# EAGLE design Terv (EAGLE 9.5.2)
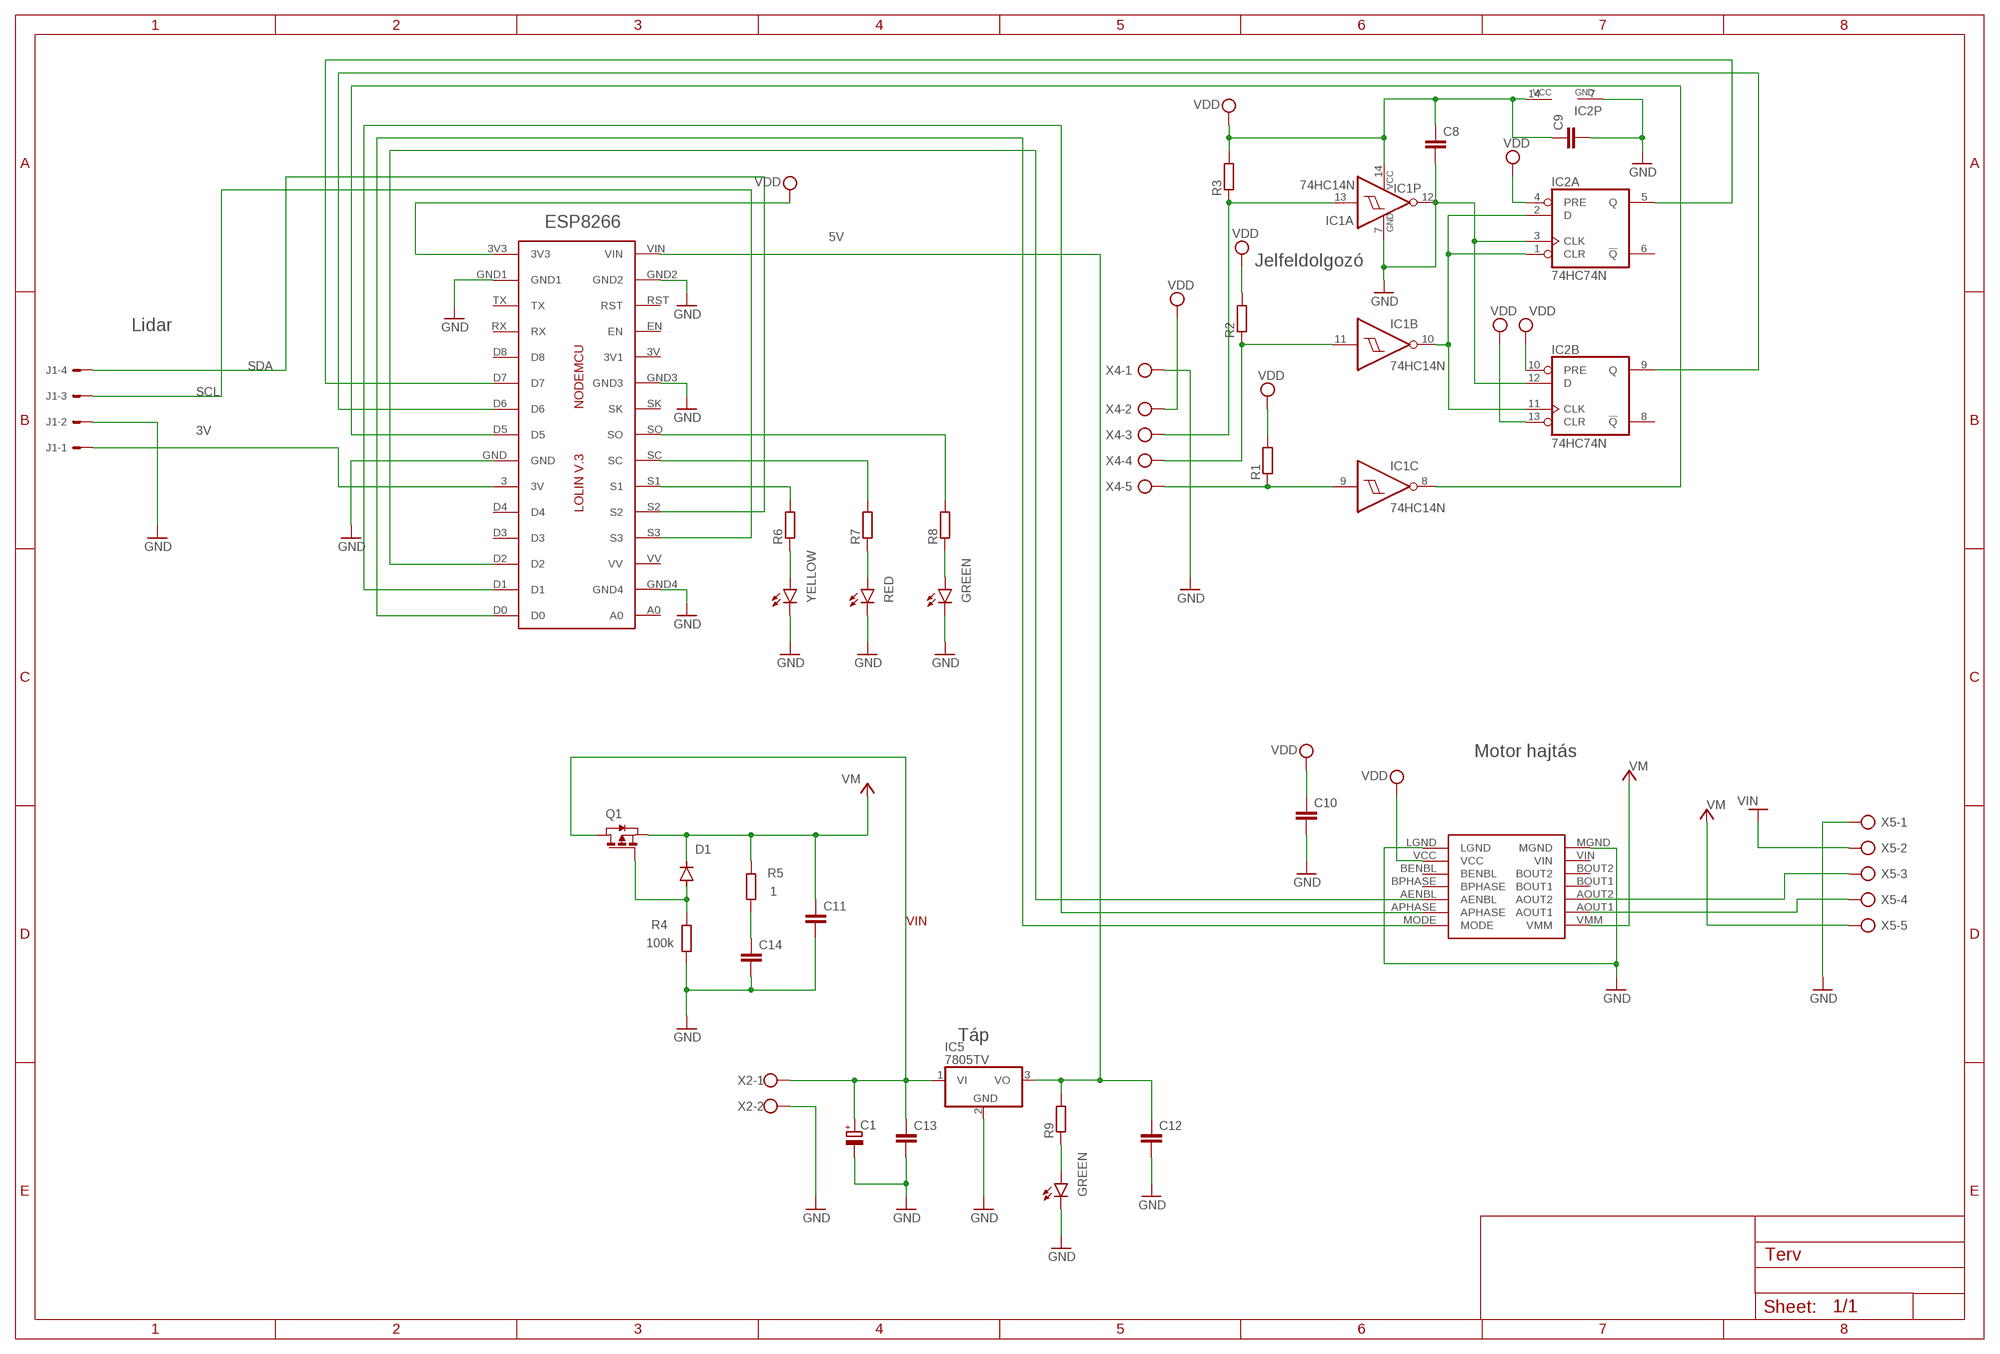
[diagram p0: schematic, sheet 1]

## Parts
C1  CPOL-EUE2.5-6  [E2,5-6]
C8  C-EU050-025X075  [C050-025X075]
C9  C-EU050-025X075  [C050-025X075]
C10  C-EU050-025X075  [C050-025X075]
C11  C-EU050-025X075  [C050-025X075]
C12  C-EU050-025X075  [C050-025X075]
C13  C-EU050-025X075  [C050-025X075]
C14  C-EU050-025X075  [C050-025X075]
D1  1N4004  [DO41-10]
IC1  74HC14N  [DIL14]
IC2  74HC74N  [DIL14]
IC4  LOLINV3  [LOLINV3]
IC5  7805TV  [TO220V]
J1  22-27-2041-04  [6410-04]
LED1  TLLY4400  [LED3MM]
LED2  TLLR4400  [LED3MM]
LED3  TLLG4400  [LED3MM]
LED4  TLLG4400  [LED3MM]
R1  R-EU_0204/7  [0204/7]
R2  R-EU_0204/7  [0204/7]
R3  R-EU_0204/7  [0204/7]
R4  R-EU_0204/7  [0204/7]
R5  R-EU_0204/7  [0204/7]
R6  R-EU_0204/7  [0204/7]
R7  R-EU_0204/7  [0204/7]
R8  R-EU_0204/7  [0204/7]
R9  R-EU_0204/7  [0204/7]
T1  PMOSE3L  [E3LINE]
U$1  POLOLU_MOTOR_DRV8835THROUGHHOLE  [POLOLU_MOTOR_DRV_DRV8835]
X2  W237-102  [W237-102]
X4  AK300/5  [AK300/5]
X5  AK300/5  [AK300/5]

## Nets
3V: IC4.3(3V) J1.1
5V: C12.1 IC4.VIN IC5.3(VO) R9.2
GND: C1.- C8.2 C9.2 C10.2 C11.2 C12.2 C13.2 C14.2 IC1.7(P:GND) IC1.12(A:O) IC2.7(P:GND) IC4.GND IC4.GND1 IC4.GND2 IC4.GND3 IC4.GND4 IC5.2(GND) J1.2 LED1.K(C) LED2.K(C) LED3.K(C) LED4.K(C) R4.1 U$1.LGND U$1.MGND X2.2 X4.1 X5.1 X5.2
N$1: IC1.9(C:I) R1.1 X4.5
N$2: IC1.10(B:O) IC2.1(A:CLR) IC2.2(A:D) IC2.11(B:CLK)
N$3: IC1.13(A:I) R3.1 X4.3
N$4: IC2.3(A:CLK) IC2.12(B:D)
N$5: IC1.11(B:I) R2.1 X4.4
N$6: IC2.5(A:Q) IC4.D7
N$7: IC2.9(B:Q) IC4.D6
N$8: IC1.8(C:O) IC4.D5
N$9: IC4.D0 U$1.MODE
N$10: IC4.D2 U$1.AENBL
N$11: IC4.S1 R6.2
N$12: U$1.AOUT2 X5.3
N$13: U$1.AOUT1 X5.4
N$14: D1.A R4.2 T1.2(G)
N$15: C14.1 R5.1
N$16: IC4.D1 U$1.APHASE
N$17: IC4.SC R7.2
N$18: IC4.SO R8.2
N$19: LED1.A R6.1
N$20: LED2.A R7.1
N$21: LED3.A R8.1
N$22: LED4.A R9.1
N$23: IC2.13(B:CLR) ; supply symbol labelled VDD
SCL: IC4.S3 J1.3
SDA: IC4.S2 J1.4
V+: C11.1 D1.C R5.2 T1.3(S) U$1.VMM X5.5
VDD: C8.1 C9.1 C10.1 IC1.14(P:VCC) IC2.4(A:PRE) IC2.10(B:PRE) IC2.14(P:VCC) IC4.3V3 R1.2 R2.2 R3.2 U$1.VCC X4.2
VIN: C1.+ C13.1 IC5.1(VI) T1.1(D) X2.1
Unconnected: IC1.1(D:I) IC1.2(D:O) IC1.3(E:I) IC1.4(E:O) IC1.5(F:I) IC1.6(F:O) IC2.6(A:!Q) IC2.8(B:!Q) IC4.3V(3V1) IC4.A0 IC4.D3 IC4.D4 IC4.D8 IC4.EN IC4.RST IC4.RX IC4.SK IC4.TX IC4.VV U$1.BENBL U$1.BOUT1 U$1.BOUT2 U$1.BPHASE U$1.VIN

## Notes on the sheet
- ESP8266
- Jelfeldolgozó
- Lidar
- Motor hajtás
- Táp

## Library data of the parts
C1 = rcl:CPOL-EU: POLARIZED CAPACITOR, European symbol; SPICEPREFIX: C
C8-C14 = rcl:C-EU: CAPACITOR, European symbol; SPICEPREFIX: C
D1 = diode:1N4004: DIODE general purpose rectifier, 1 A
IC1 = 74xx-eu:74*14: Hex schmitt trigger INVERTER
IC2 = 74xx-eu:74*74: Dual D type positive edge triggered FLIP FLOP, preset and clear
IC4 = Lolin:LOLINV3
IC5 = linear:78*: Positive VOLTAGE REGULATOR Source: http://cache.national.com/ds/LM/LM78L05.pdf http://www.fairchildsemi.com/ds/LM/LM7805.pdf
J1 = con-molex:22-?-04: CONNECTOR wire to board 2.54 mm (.1 inch) pitch header; MF: MOLEX; OC_FARNELL: unknown; OC_NEWARK: unknown
LED1 = led:TLLY4400: Low Current (2mA) LED 3 mm Tinted Diffused Package color YELLOW Source: Data sheet <http://www.farnell.com/datasheets/391098.pdf>; MF: VISHAY SEMICONDUCTOR; OC_FARNELL: 1612439
LED2 = led:TLLR4400: Low Current (2mA) LED 3 mm Tinted Diffused Package color RED Source: Data sheet <http://www.farnell.com/datasheets/391100.pdf>; MF: VISHAY SEMICONDUCTOR; OC_FARNELL: 1612437
LED3 LED4 = led:TLLG4400: Low Current (2mA) LED 3 mm Tinted Diffused Package color GREEN Source: Data sheet <http://www.farnell.com/datasheets/391098.pdf>; MF: VISHAY SEMICONDUCTOR; OC_FARNELL: 1612435
R1-R3 R6-R9 = rcl:R-EU_: RESISTOR, European symbol; SPICEPREFIX: R
R4 = rcl:R-EU_: RESISTOR, European symbol; R1: 100k
R5 = rcl:R-EU_: RESISTOR, European symbol; 1: 1
T1 = zetex:PMOSE3L: MOS FET; OC_FARNELL: unknown; OC_NEWARK: unknown
U$1 = pololu:POLOLU_MOTOR_DRV8835
X2 = con-wago-500:W237-102: WAGO SCREW CLAMP; MPN: 237-102; OC_FARNELL: unknown; OC_NEWARK: 70K9898
X4 = con-ptr500:AK300/5: CONNECTOR; OC_FARNELL: unknown; OC_NEWARK: unknown; SPICEPREFIX: X
X5 = con-ptr500:AK300/5: CONNECTOR; OC_FARNELL: unknown; OC_NEWARK: unknown

## Net classes
0 default: width 0.406 mm, drill 0.508 mm, clearance 0.305 mm

## Board
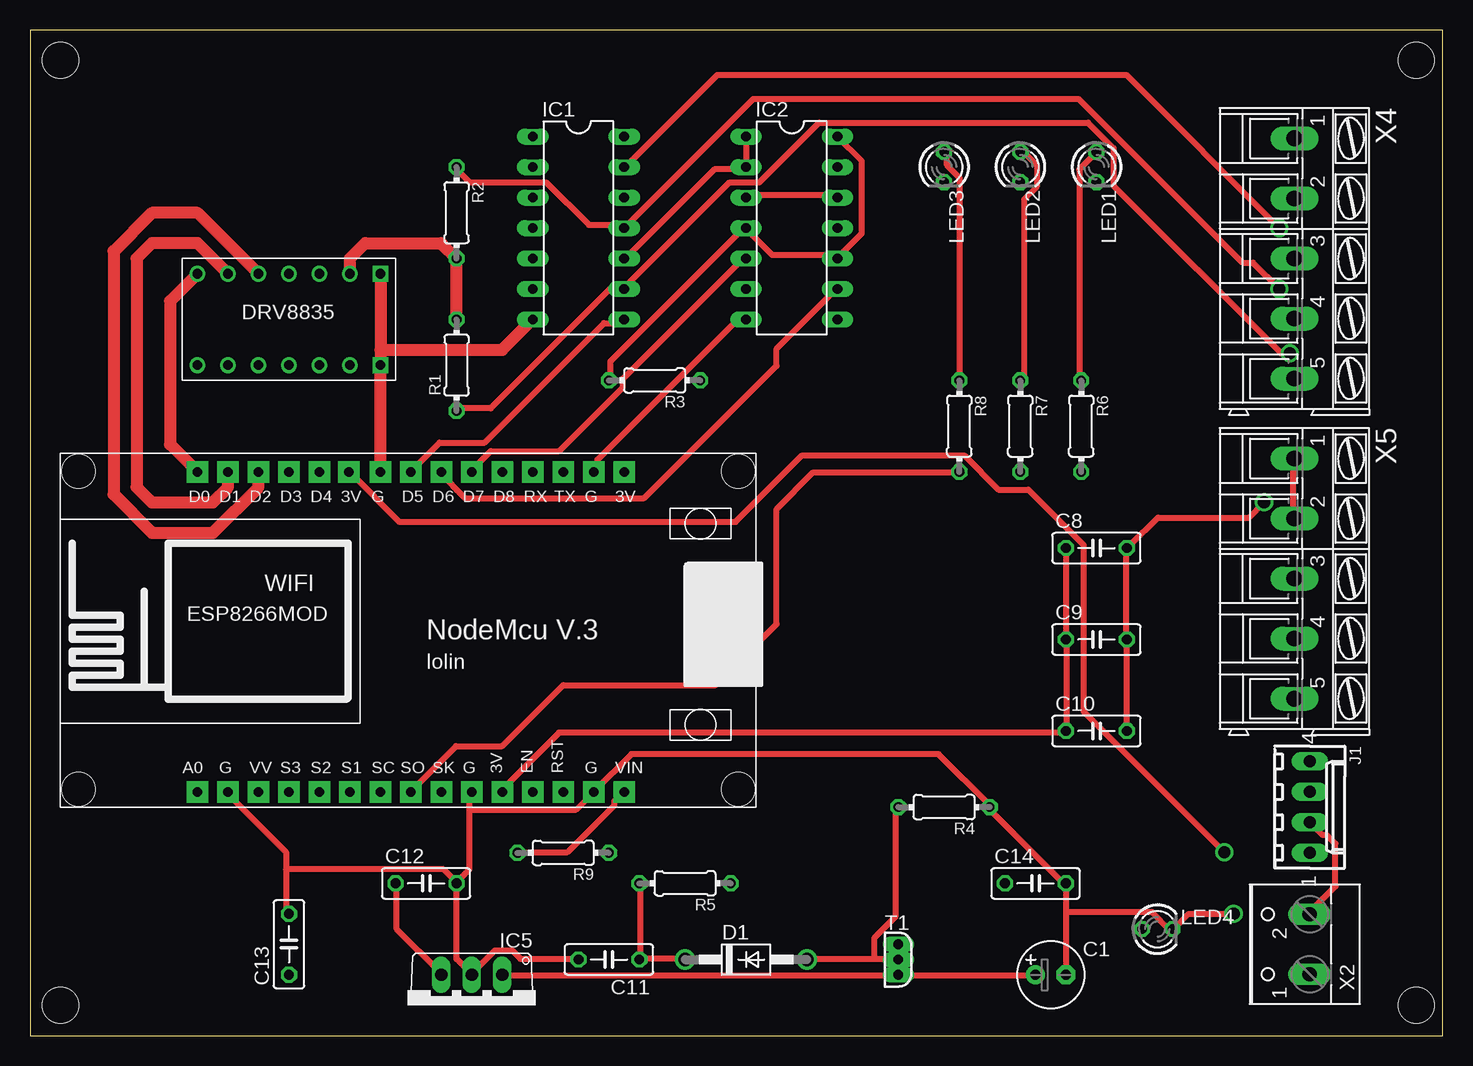
[diagram p1: board, top side]
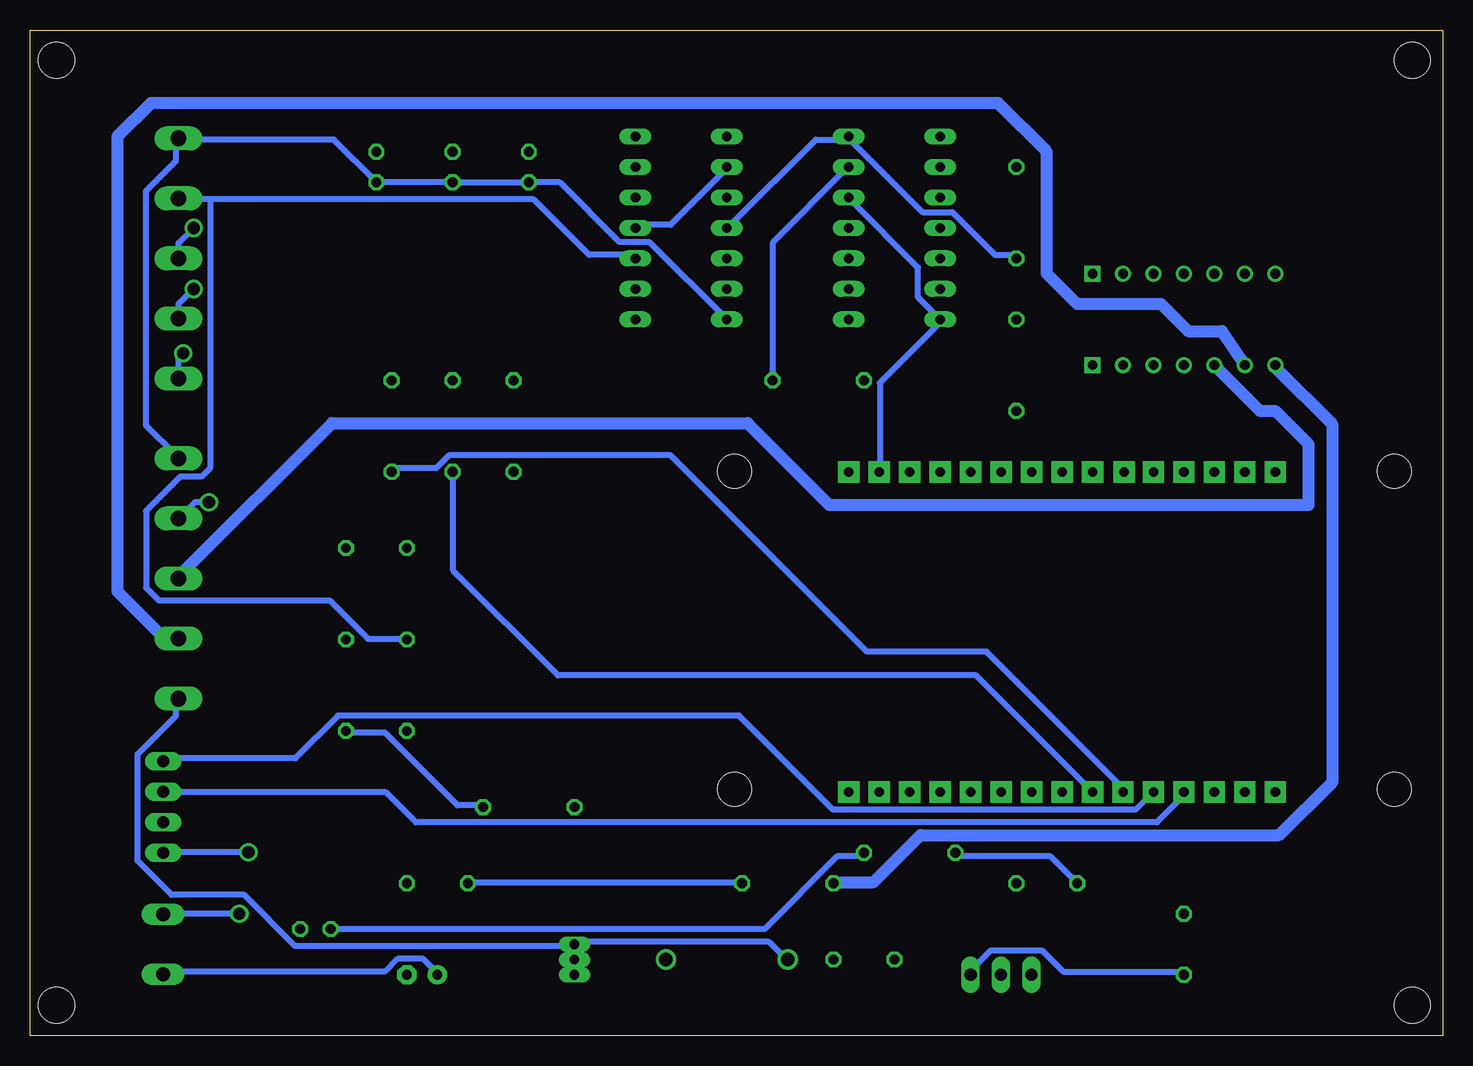
[diagram p2: board, bottom side, seen from below]

Size 117.78 x 83.81 mm. Coordinates in mm from the lower left corner, seen from the top.
Outline: 0,0 117.78,0 117.78,83.81 0,83.81 0,0
Copper layers (1*16): Top 0.035mm / dielectric 1.5mm / Bottom 0.035mm
Design rules "default": minimum track width 6mil, minimum drill 0.35mm, track to track 6mil, track to pad 6mil, pad to pad 6mil, via to via 6mil, smd to smd 6mil, copper to edge 40mil, drill to drill 6mil, minimum pad ring 10mil, minimum via ring 8mil, stop-mask expansion 4mil, vias tented up to drill 0mil, thermal gap 10mil
Holes 3 mm at 2.54,81.28 2.54,2.54 115.57,2.54 115.57,81.28

### Footprints (pad centres in the part's own frame; a part is rotated, then mirrored left to right if it is on the bottom)
E2,5-6 = drill 0.813 pad 1.6: + -1.27,0 | drill 0.813 pad 1.6 octagon: - 1.27,0
C050-025X075 = drill 0.813 octagon: 1 -2.54,0; 2 2.54,0
DO41-10 = drill 1.118: A 5.08,0; C -5.08,0
DIL14 = drill 0.813 long: 1 -7.62,-3.81; 2 -5.08,-3.81; 3 -2.54,-3.81; 4 0,-3.81; 5 2.54,-3.81; 6 5.08,-3.81; 7 7.62,-3.81; 8 7.62,3.81; 9 5.08,3.81; 10 2.54,3.81; 11 0,3.81; 12 -2.54,3.81; 13 -5.08,3.81; 14 -7.62,3.81
LOLINV3 = drill 0.8 pad 1.778 square: 3 24.03,27.94; 3V 46.99,27.94; 3V3 36.83,1.27; A0 11.43,1.27; D0 11.43,27.94; D1 13.97,27.94; D2 16.51,27.94; D3 19.05,27.94; D4 21.59,27.94; D5 29.21,27.94; D6 31.75,27.94; D7 34.29,27.94; D8 36.83,27.94; EN 39.37,1.27; GND 26.67,27.94; GND1 44.45,27.94; GND2 44.45,1.27; GND3 34.29,1.27; GND4 13.97,1.27; RST 41.91,1.27; RX 39.37,27.94; S1 24.13,1.27; S2 21.59,1.27; S3 19.05,1.27; SC 26.67,1.27; SK 31.75,1.27; SO 29.21,1.27; TX 41.91,27.94; VIN 46.99,1.27; VV 16.51,1.27 | hole 2.8: 56.5,28; 56.5,1.5; 1.5,1.5; 1.5,28
TO220V = drill 1.016 long: 1 -2.54,-2.54; 2 0,-2.54; 3 2.54,-2.54
6410-04 = drill 1.016 long: 1 3.81,0; 2 1.27,0; 3 -1.27,0; 4 -3.81,0
LED3MM = drill 0.813 octagon: A -1.27,0; K 1.27,0
0204/7 = drill 0.813 octagon: 1 -3.81,0; 2 3.81,0
E3LINE = drill 0.8 pad 0.889 long: 1 0,-1.27; 2 0,0; 3 0,1.27
POLOLU_MOTOR_DRV_DRV8835 = drill 0.8: AENBL 1.27,6.35; AOUT1 8.89,3.81; AOUT2 8.89,6.35; APHASE 1.27,3.81; BENBL 1.27,11.43; BOUT1 8.89,8.89; BOUT2 8.89,11.43; BPHASE 1.27,8.89; MODE 1.27,1.27; VCC 1.27,13.97; VIN 8.89,13.97; VMM 8.89,1.27 | drill 0.8 square: LGND 1.27,16.51; MGND 8.89,16.51
W237-102 = drill 1.194 long: 1 -2.5,-1.27; 2 2.5,-1.27
AK300/5 = drill 1.321 long: 1 -10.008,0; 2 -5.004,0; 3 0,0; 4 5.004,0; 5 10.008,0

### Placement (x,y rotation side)
C1  85.09,5.08 0 top
C8  88.9,40.64 0 top
C9  88.9,33.02 0 top
C10  88.9,25.4 0 top
C11  48.26,6.35 180 top
C12  33.02,12.7 0 top
C13  21.59,7.62 90 top
C14  83.82,12.7 0 top
D1  59.69,6.35 0 top
IC1  45.72,67.31 270 top
IC2  63.5,67.31 270 top
IC4  2.54,19.05 0 top
IC5  36.83,2.54 180 top
J1  106.68,19.05 270 top
LED1  88.9,72.39 270 top
LED2  82.55,72.39 270 top
LED3  76.2,72.39 270 top
LED4  93.98,8.89 0 top
R1  35.56,55.88 90 top
R2  35.56,68.58 270 top
R3  52.07,54.61 180 top
R4  76.2,19.05 180 top
R5  54.61,12.7 180 top
R6  87.63,50.8 270 top
R7  82.55,50.8 270 top
R8  77.47,50.8 270 top
R9  44.45,15.24 180 top
T1  72.39,6.35 0 top
U$1  12.7,64.77 270 top
X2  105.41,7.62 90 top
X4  105.41,64.77 270 top
X5  105.41,38.1 270 top

### Tracks (layer width: path | path; a pad name or v marks a point on that pad's centre or on a via)
3V  (via drill 1.02)
  Top 0.508: IC4.3 26.67,46.94 30.79,42.82 58.83,42.82 64.36,48.36 77.88,48.36 80.72,45.52 83.21,45.52 87.83,40.89 87.83,27.03 v99.57,15.29
  Bottom 0.508: v99.57,15.29 106.63,15.29 J1.1
5V
  Top 0.508: C12.1 30.58,12.45 30.58,8.89 34.14,5.33 IC5.3 | IC4.VIN 49.43,20.27 48.72,19.56 48.72,19.2 44.81,15.29 40.89,15.29 R9.2
  Bottom 0.508: C12.1 32.72,14.94 40.54,14.94 R9.2
GND  (via drill 1.02)
  Top 0.508: IC2.7 59.38,59.38 58.67,59.38 47.3,48.01 47.3,47.3 IC4.GND1 | 21.34,13.87 21.34,15.29 16.36,20.27 IC4.GND4 | 21.34,13.87 21.34,10.31 C13.2 | C11.2 45.52,6.4 40.89,6.4 40.18,7.11 38.76,7.11 36.98,5.33 IC5.2 36.63,5.33 35.56,6.4 C12.2 35.56,12.8 | 36.63,18.85 36.63,13.87 35.56,12.8 | 36.63,18.85 36.63,20.27 IC4.GND3 | 36.63,18.85 45.52,18.85 IC4.GND2 50.14,23.47 75.74,23.47 80.01,19.2 R4.1 80.01,18.85 86.06,12.8 C14.2 86.41,12.45 86.41,10.31 | 21.34,13.87 34.49,13.87 35.56,12.8 | X5.2 105.26,43.38 105.26,48.01 X5.1 | C10.2 91.39,25.6 91.39,32.72 C9.2 91.39,33.07 91.39,40.54 C8.2 91.75,40.89 94.03,43.18 101.6,43.18 v102.87,44.45 | J1.2 107.75,16.71 108.1,16.71 108.81,16 108.81,12.45 106.68,10.31 X2.2 | 86.41,10.31 86.41,5.33 C1.- | 86.41,10.31 93.52,10.31 94.94,8.89 LED4.K 95.3,8.89 96.57,10.16 v100.33,10.16
  Top 1.016: IC4.GND U$1.MGND 29.21,57.15 | U$1.LGND 29.21,57.15 | IC1.7 39.37,57.15 29.21,57.15
  Bottom 0.508: IC1.12 49.43,69.7 43.74,64.01 43.74,61.52 IC1.7 41.96,59.38 46.94,54.41 46.94,47.3 IC4.GND1 | IC2.7 66.14,66.14 68.63,66.14 73.61,71.12 LED3.K LED2.K LED1.K 92.46,74.68 105.26,74.68 X4.1 105.61,74.68 105.61,72.9 108.1,70.41 108.1,50.85 105.61,48.36 X5.1 | C10.2 91.39,25.25 88.19,25.25 82.14,19.2 80.01,19.2 R4.1 | v100.33,10.16 106.64,10.16 X2.2 | v102.87,44.45 104.06,44.45 X5.2
N$1  (via drill 1.02)
  Top 0.508: 49.43,62.23 48.36,62.23 38.41,52.27 35.56,52.27 R1.1 | 49.43,62.23 58.32,71.12 60.81,71.12 65.79,76.1 88.19,76.1 90.32,73.97 90.32,70.84 104.29,56.87 v105.01,56.87 | 49.43,62.23 IC1.9
  Bottom 0.508: v105.01,56.87 105.41,56.47 X4.5
N$2
  Top 0.406: 59.74,72.54 IC2.2
  Top 0.508: IC1.10 49.78,65.08 49.94,65.08 57.05,72.19 59.38,72.19 IC2.2 | 59.74,72.54 59.74,74.68 IC2.1
  Bottom 0.508: IC2.11 67.21,67.56 64.36,67.56 59.74,72.19 IC2.2
N$3  (via drill 1.02)
  Top 0.508: IC1.13 49.78,72.54 57.3,80.06 91.39,80.06 v104.14,67.31
  Bottom 0.508: IC1.13 49.78,72.19 55.83,66.14 55.83,54.76 R3.1 | v104.14,67.31 105.41,66.04 X4.3
N$4
  Top 0.508: IC2.3 59.74,70.05 67.21,70.05 IC2.12
N$5  (via drill 1.02)
  Top 0.508: R2.1 35.56,72.19 36.63,71.12 43.03,71.12 46.58,67.56 49.43,67.56 IC1.11 60.3,78.08 87.41,78.08 101.07,64.41 101.96,64.41 v104.14,62.23
  Bottom 0.508: v104.14,62.23 105.41,60.96 X4.4
N$6
  Top 0.508: IC2.5 59.38,64.72 49.43,54.76 49.43,54.05 44.09,48.72 38.41,48.72 36.98,47.3 IC4.D7
N$7
  Top 0.508: IC2.9 67.21,62.23 62.23,57.25 62.23,55.83 51.21,44.81 36.27,44.81 34.14,46.94 IC4.D6
N$8
  Top 0.508: IC1.8 49.43,59.38 47.85,59.38 37.9,49.43 34.14,49.43 32,47.3 IC4.D5
N$9
  Top 1.016: U$1.MODE 11.68,61.21 11.68,49.28 IC4.D0
N$10
  Top 1.016: U$1.AENBL 13.97,68.58 10.16,68.58 6.96,65.38 6.96,45.11 10.16,41.91 15.24,41.91 19.05,45.72 IC4.D2
N$11
  Bottom 0.508: R6.2 87.48,47.3 83.92,47.3 82.86,48.36 64.36,48.36 48.01,32 38.05,32 26.67,20.62 IC4.S1
N$12
  Bottom 1.016: U$1.AOUT2 15.24,52.07 13.97,52.07 11.18,49.28 11.18,44.25 51.16,44.25 57.96,51.05 92.61,51.05 105.26,38.41 X5.3
N$13
  Bottom 1.016: X5.4 106.55,33.1 110.49,37.03 110.49,74.93 107.7,77.72 37.08,77.72 33.02,73.66 33.02,63.5 30.48,60.96 23.47,60.96 21.23,58.73 18.41,58.73 U$1.AOUT1
N$14
  Top 0.508: 70.41,6.4 65.08,6.4 D1.A | 70.41,6.4 72.19,6.4 T1.2 | 70.41,6.4 70.41,8.18 72.19,9.96 72.19,18.85 R4.2
N$15
  Bottom 0.508: R5.1 58.67,12.8 81.08,12.8 C14.1
N$16
  Top 1.016: U$1.APHASE 13.97,66.04 10.16,66.04 8.89,64.77 8.89,45.72 10.16,44.45 15.24,44.45 16.51,45.72 IC4.D1
N$17
  Bottom 0.508: IC4.SC 38.91,30.02 73.76,30.02 82.5,38.76 82.5,46.94 R7.2
N$18
  Top 0.508: R8.2 77.17,46.94 65.28,46.94 62.23,43.89 62.23,34.29 57.15,29.21 44.45,29.21 39.37,24.13 35.51,24.13 32,20.62 IC4.SO
N$19
  Top 0.508: R6.1 87.48,54.76 87.48,72.19 88.9,73.61 LED1.A
N$20
  Top 0.508: R7.1 82.86,54.76 82.86,69.7 83.92,70.76 83.92,72.54 82.86,73.61 LED2.A
N$21
  Top 0.508: LED3.A 76.45,73.61 76.45,72.54 77.52,71.48 77.52,54.76 R8.1
N$22
  Bottom 0.508: LED4.A 56.54,8.89 50.49,14.94 48.36,14.94 R9.1
SCL
  Bottom 0.508: J1.3 106.68,20.27 88.09,20.27 85.6,17.78 23.82,17.78 21.34,20.27 IC4.S3
SDA
  Bottom 0.508: IC4.S2 25.6,18.85 50.85,18.85 58.67,26.67 92.1,26.67 95.66,23.11 106.68,23.11 J1.4
V+
  Top 0.508: 50.85,6.4 54.41,6.4 D1.C | 50.85,6.4 50.85,12.45 R5.2 | 50.85,6.4 C11.1
  Bottom 0.508: D1.C 54.76,6.4 56.19,7.82 72.19,7.82 T1.3 72.54,7.82 73.25,7.82 73.61,7.47 95.66,7.47 99.92,11.73 105.97,11.73 108.81,14.58 108.81,23.47 105.61,26.67 105.61,28.09 X5.5
  Bottom 1.016: U$1.VMM 13.87,55.83 13.87,55.58 9.2,50.9 9.2,21.18 13.66,16.71 43.54,16.71 47.45,12.8 50.49,12.8 R5.2
VDD
  Top 0.508: C8.1 86.41,40.54 86.41,33.07 C9.1 86.41,32.72 86.41,25.6 C10.1 86.06,25.25 44.09,25.25 39.47,20.62 IC4.3V3 | R3.2 48.36,54.76 48.36,56.19 59.38,67.21 IC2.4 59.74,67.21 61.87,65.08 67.21,65.08 IC2.10 67.56,65.08 69.34,66.85 69.34,72.9 IC2.14
  Top 1.016: R1.2 R2.2 34.29,66.04 27.94,66.04 26.67,64.77 U$1.VCC
  Bottom 0.508: IC2.4 59.38,67.56 52.27,74.68 49.78,74.68 IC1.14 49.43,74.68 43.38,68.63 40.89,68.63 37.34,65.08 35.56,65.08 R2.2 | 102.77,69.7 75.79,69.7 71.17,65.08 67.56,65.08 IC2.10 | 102.77,69.7 105.26,69.7 X4.2 | 102.77,69.7 102.77,47.3 103.48,46.58 105.26,46.58 108.1,43.74 108.1,37.34 107.04,36.27 92.81,36.27 89.61,33.07 86.41,33.07 C9.1
VIN
  Top 0.508: C1.+ 83.57,4.98 72.54,4.98 T1.1 72.19,4.98 39.47,4.98 IC5.1
  Bottom 0.508: C13.1 21.69,5.33 31.65,5.33 33.43,7.11 37.69,7.11 39.47,5.33 IC5.1 | X2.1 106.68,5.33 88.19,5.33 87.12,6.4 84.99,6.4 83.92,5.33 C1.+